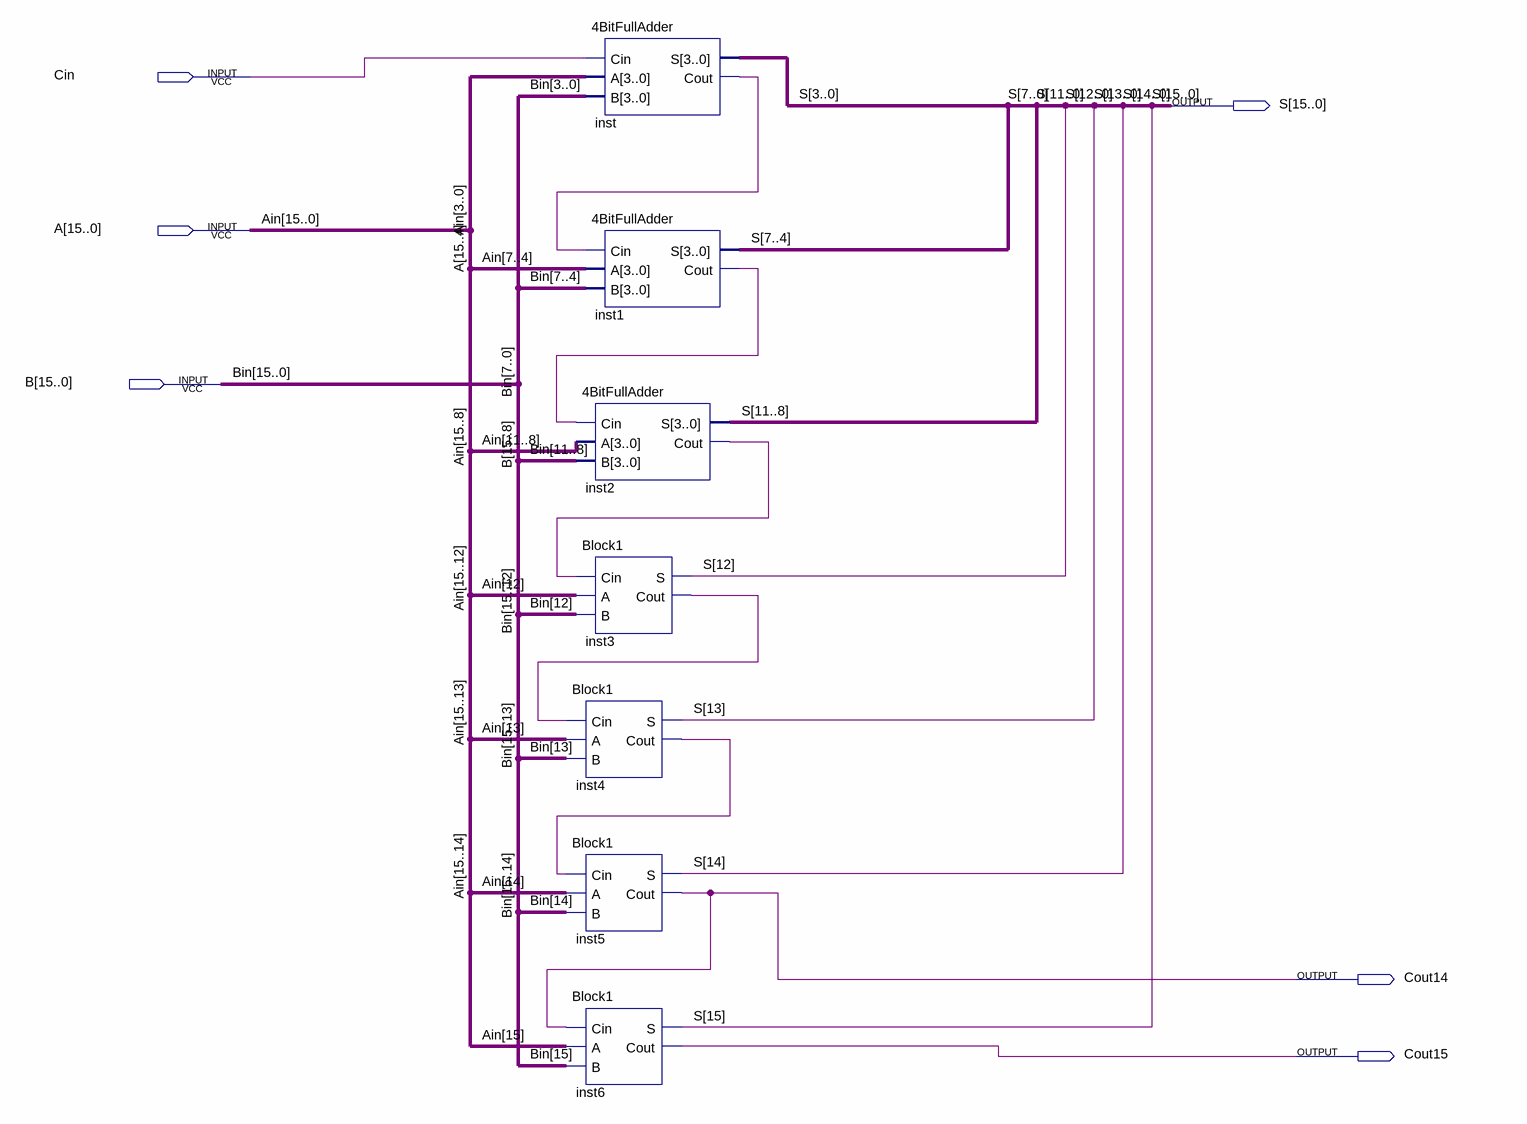
[diagram p0: schematic sheet]
// Quartus schematic 16bitfulladder.bdf as structural Verilog: 7 symbols, 6 pins
module \16bitfulladder  (
  input  Cin,
  input  [15:0] A,
  input  [15:0] B,
  output [15:0] S,
  output Cout14,
  output Cout15
);

  wire inst1_cout, inst2_cout, inst3_cout, inst4_cout, inst_cout;

  \4BitFullAdder  inst (.Cin(Cin), .A(A[3:0]), .B(B[3:0]), .S(S[3:0]), .Cout(inst_cout));
  \4BitFullAdder  inst1 (.Cin(inst_cout), .A(A[7:4]), .B(B[7:4]), .S(S[7:4]), .Cout(inst1_cout));
  \4BitFullAdder  inst2 (.Cin(inst1_cout), .A(A[11:8]), .B(B[11:8]), .S(S[11:8]), .Cout(inst2_cout));
  Block1 inst3 (.Cin(inst2_cout), .A(A[12]), .B(B[12]), .S(S[12]), .Cout(inst3_cout));
  Block1 inst4 (.Cin(inst3_cout), .A(A[13]), .B(B[13]), .S(S[13]), .Cout(inst4_cout));
  Block1 inst5 (.Cin(inst4_cout), .A(A[14]), .B(B[14]), .S(S[14]), .Cout(Cout14));
  Block1 inst6 (.Cin(Cout14), .A(A[15]), .B(B[15]), .S(S[15]), .Cout(Cout15));

  // Other names for the same wires on the sheet: Ain[15:0] = A; Bin[15:0] = B
endmodule
